# EAGLE design buttons (EAGLE 9.3.0)
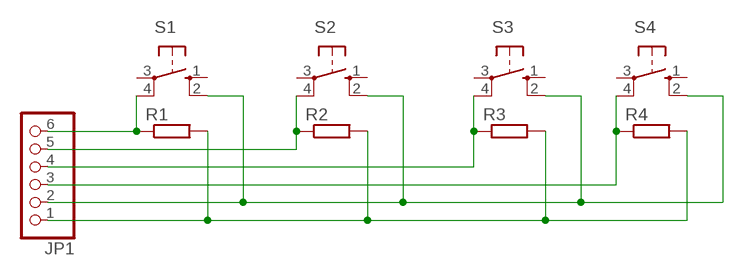
[diagram p0: schematic, sheet 1]

## Parts
JP1  PINHD-1X6/90  [1X06/90]
R1  R-EU_0207/10  [0207/10]
R2  R-EU_0207/10  [0207/10]
R3  R-EU_0207/10  [0207/10]
R4  R-EU_0207/10  [0207/10]
S1  10-XX  [B3F-10XX]
S2  10-XX  [B3F-10XX]
S3  10-XX  [B3F-10XX]
S4  10-XX  [B3F-10XX]

## Nets
N$1: JP1.6 R1.1 S1.4(P1)
N$2: JP1.5 R2.1 S2.4(P1)
N$3: JP1.4 R3.1 S3.4(P1)
N$4: JP1.3 R4.1 S4.4(P1)
N$5: JP1.2 S1.2(S1) S2.2(S1) S3.2(S1) S4.2(S1)
N$7: JP1.1 R1.2 R2.2 R3.2 R4.2
Unconnected: S1.1(S) S1.3(P) S2.1(S) S2.3(P) S3.1(S) S3.3(P) S4.1(S) S4.3(P)

## Library data of the parts
JP1 = pinhead:PINHD-1X6: PIN HEADER
R1-R4 = rcl:R-EU_: RESISTOR, European symbol; SPICEPREFIX: R
S1-S4 = switch-omron:10-XX: OMRON SWITCH; MPN: B3F-1000; OC_FARNELL: 176432; OC_NEWARK: 36M3542

## Board
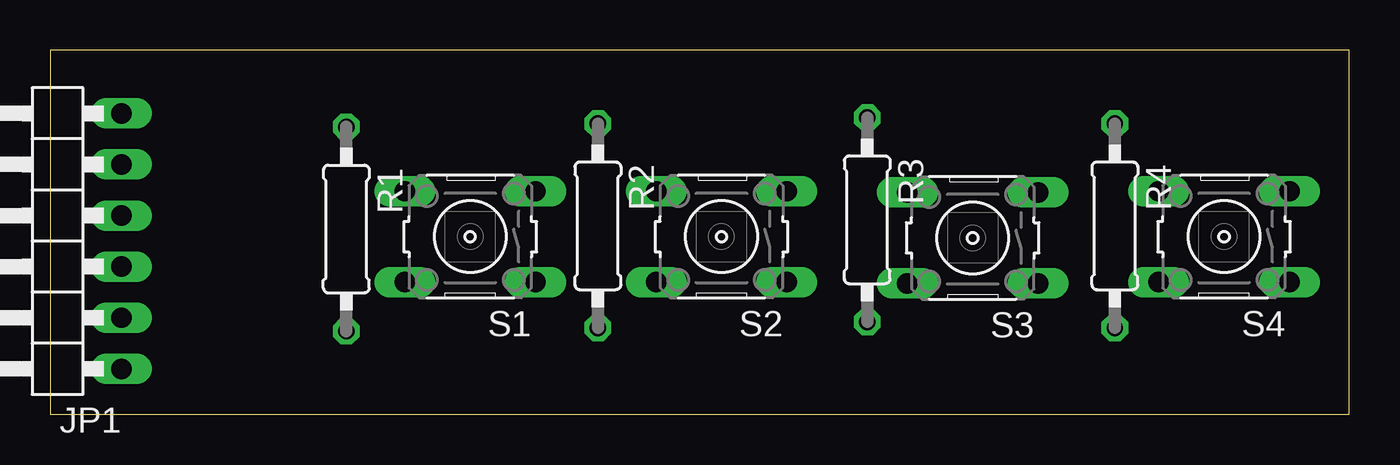
[diagram p1: board, top side]
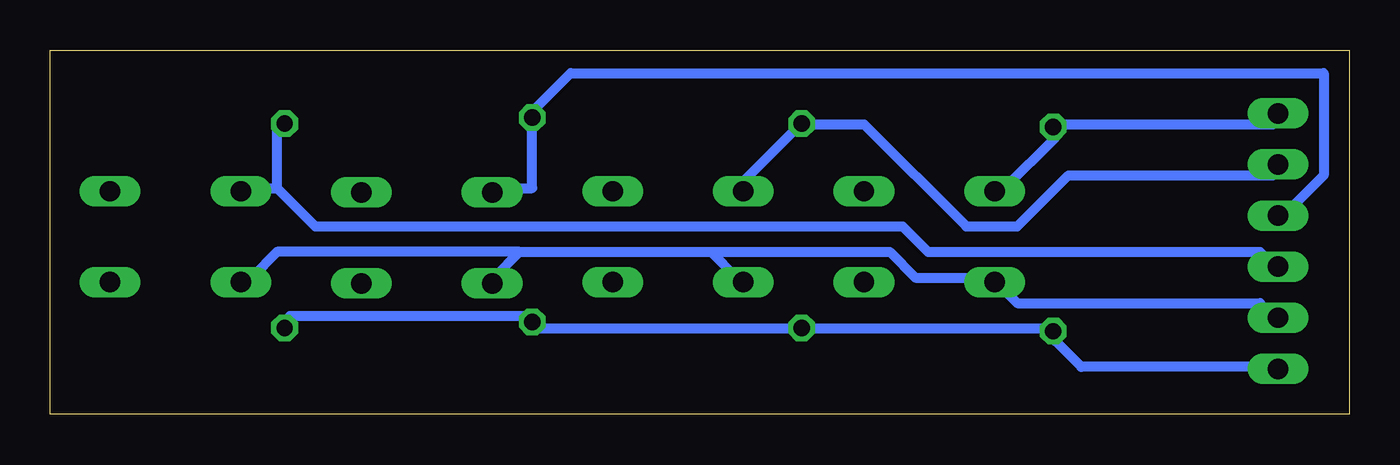
[diagram p2: board, bottom side, seen from below]

Size 64.62 x 18.11 mm. Coordinates in mm from the lower left corner, seen from the top.
Outline: 0,0 64.62,0 64.62,18.11 0,18.11 0,0
Copper layers (1*16): Top 0.035mm / dielectric 1.5mm / Bottom 0.035mm
Design rules "default *": minimum track width 20mil, minimum drill 0.35mm, track to track 16mil, track to pad 16mil, pad to pad 16mil, via to via 16mil, smd to smd 16mil, copper to edge 16mil, drill to drill 6mil, minimum pad ring 10mil, minimum via ring 8mil, stop-mask expansion 4mil, vias tented up to drill 0mil, thermal gap 10mil

### Footprints (pad centres in the part's own frame; a part is rotated, then mirrored left to right if it is on the bottom)
1X06/90 = drill 1.016 long: 1 -6.35,-3.81; 2 -3.81,-3.81; 3 -1.27,-3.81; 4 1.27,-3.81; 5 3.81,-3.81; 6 6.35,-3.81
0207/10 = drill 0.813 octagon: 1 -5.08,0; 2 5.08,0
B3F-10XX = drill 1.016 long: 1 -3.251,2.261; 2 3.251,2.261; 3 -3.251,-2.261; 4 3.251,-2.261

### Placement (x,y rotation side)
JP1  -0.27,8.62 90 top
R1  14.73,9.22 270 top
R2  27.24,9.38 270 top
R3  40.64,9.68 270 top
R4  52.96,9.38 270 top
S1  20.89,8.84 180 top
S2  33.39,8.84 180 top
S3  45.89,8.78 180 top
S4  58.39,8.84 180 top

### Tracks (layer width: path | path; a pad name or v marks a point on that pad's centre or on a via)
N$1
  Bottom 0.508: S1.4 17.15,11.25 14.61,13.79 R1.1 14.61,14.43 3.81,14.43 JP1.6
N$2
  Bottom 0.508: S2.4 30.48,11.25 27.3,14.43 R2.1 26.67,14.43 24.13,14.43 19.05,9.35 16.51,9.35 13.97,11.89 3.81,11.89 JP1.5
N$3
  Bottom 0.508: S3.4 42.55,11.25 40.64,11.25 R3.1 40.64,15.07 38.73,16.97 1.27,16.97 1.27,11.89 3.18,9.98 JP1.4
N$4
  Bottom 0.508: 53.34,11.25 53.34,14.43 R4.1 | 53.34,11.25 54.61,11.25 S4.4 | 53.34,11.25 51.44,9.35 22.23,9.35 20.95,8.08 4.45,8.08 3.81,7.45 JP1.3
N$5
  Bottom 0.508: JP1.2 3.81,4.9 4.45,5.54 16.51,5.54 17.15,6.18 S1.2 17.78,6.81 21.59,6.81 22.86,8.08 31.75,8.08 | 31.75,8.08 30.48,6.81 S2.2 | 41.27,8.08 31.75,8.08 | 41.27,8.08 42.55,6.81 S3.2 | 41.27,8.08 53.34,8.08 54.61,6.81 S4.2
N$7
  Bottom 0.508: R4.2 52.7,4.9 40.64,4.9 R3.2 40.64,4.27 27.3,4.27 R2.2 26.67,4.27 15.24,4.27 R1.2 14.61,3.63 13.34,2.37 3.81,2.37 JP1.1